# EasyEDA schematic 1-Schematic.json
TITLE: 7-digit Decade Box; REV: 1.0; Date: 2018-09-18; Sheet: 1/1; Drawn By: tardate
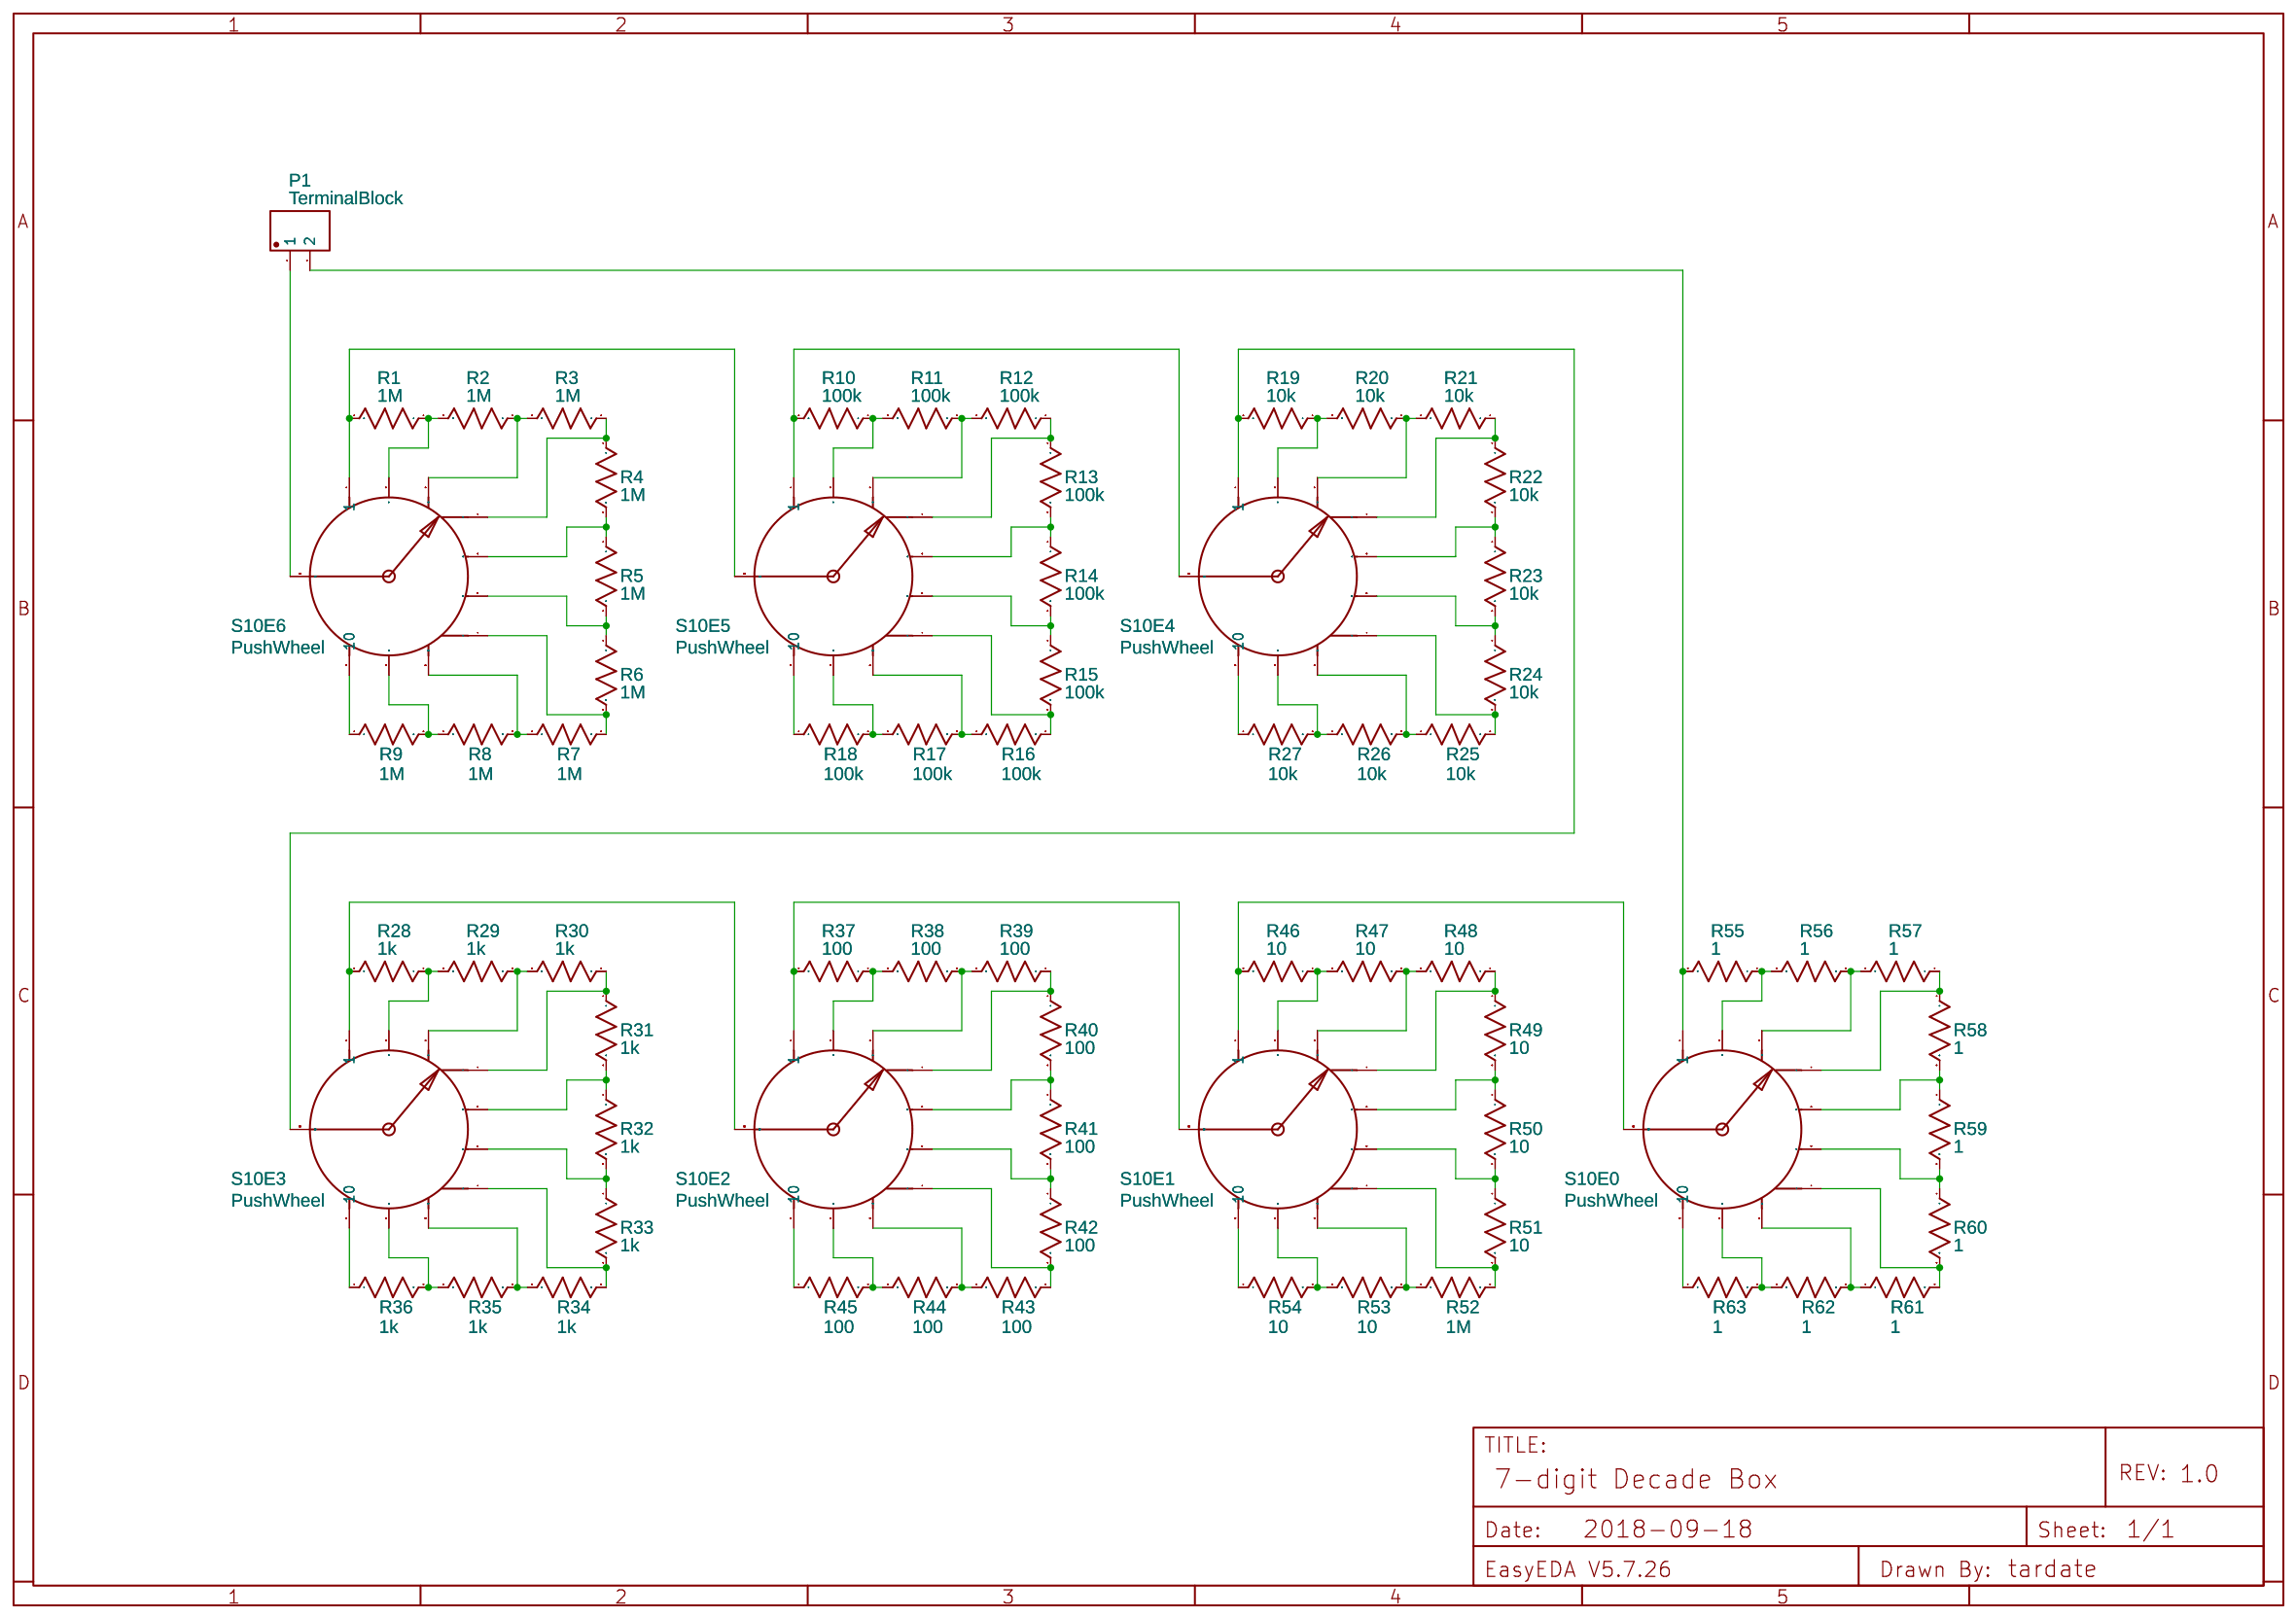
[diagram p0: schematic sheet]

## Parts
P1  TerminalBlock  [WJ2EDGVC-5.08-2P]
R1  1M  [AXIAL-0.3]
R2  1M  [AXIAL-0.3]
R3  1M  [AXIAL-0.3]
R4  1M  [AXIAL-0.3]
R5  1M  [AXIAL-0.3]
R6  1M  [AXIAL-0.3]
R7  1M  [AXIAL-0.3]
R8  1M  [AXIAL-0.3]
R9  1M  [AXIAL-0.3]
R10  100k  [AXIAL-0.3]
R11  100k  [AXIAL-0.3]
R12  100k  [AXIAL-0.3]
R13  100k  [AXIAL-0.3]
R14  100k  [AXIAL-0.3]
R15  100k  [AXIAL-0.3]
R16  100k  [AXIAL-0.3]
R17  100k  [AXIAL-0.3]
R18  100k  [AXIAL-0.3]
R19  10k  [AXIAL-0.3]
R20  10k  [AXIAL-0.3]
R21  10k  [AXIAL-0.3]
R22  10k  [AXIAL-0.3]
R23  10k  [AXIAL-0.3]
R24  10k  [AXIAL-0.3]
R25  10k  [AXIAL-0.3]
R26  10k  [AXIAL-0.3]
R27  10k  [AXIAL-0.3]
R28  1k  [AXIAL-0.3]
R29  1k  [AXIAL-0.3]
R30  1k  [AXIAL-0.3]
R31  1k  [AXIAL-0.3]
R32  1k  [AXIAL-0.3]
R33  1k  [AXIAL-0.3]
R34  1k  [AXIAL-0.3]
R35  1k  [AXIAL-0.3]
R36  1k  [AXIAL-0.3]
R37  100  [AXIAL-0.3]
R38  100  [AXIAL-0.3]
R39  100  [AXIAL-0.3]
R40  100  [AXIAL-0.3]
R41  100  [AXIAL-0.3]
R42  100  [AXIAL-0.3]
R43  100  [AXIAL-0.3]
R44  100  [AXIAL-0.3]
R45  100  [AXIAL-0.3]
R46  10  [AXIAL-0.3]
R47  10  [AXIAL-0.3]
R48  10  [AXIAL-0.3]
R49  10  [AXIAL-0.3]
R50  10  [AXIAL-0.3]
R51  10  [AXIAL-0.3]
R52  1M  [AXIAL-0.3]
R53  10  [AXIAL-0.3]
R54  10  [AXIAL-0.3]
R55  1  [AXIAL-0.3]
R56  1  [AXIAL-0.3]
R57  1  [AXIAL-0.3]
R58  1  [AXIAL-0.3]
R59  1  [AXIAL-0.3]
R60  1  [AXIAL-0.3]
R61  1  [AXIAL-0.3]
R62  1  [AXIAL-0.3]
R63  1  [AXIAL-0.3]
S10E0  PushWheel  [ROTARY_SWITCH_1X10_KIT]
S10E1  PushWheel  [ROTARY_SWITCH_1X10_KIT]
S10E2  PushWheel  [ROTARY_SWITCH_1X10_KIT]
S10E3  PushWheel  [ROTARY_SWITCH_1X10_KIT]
S10E4  PushWheel  [ROTARY_SWITCH_1X10_KIT]
S10E5  PushWheel  [ROTARY_SWITCH_1X10_KIT]
S10E6  PushWheel  [ROTARY_SWITCH_1X10_KIT]

## Library data of the parts
P1 = -: Supplier Part: C8445; Supplier: LCSC; Manufacturer: ReliaPro; image: //image.lceda.cn/szlcsc/C8445.jpg
R1-R63 = Res_AXIAL-0.3(1/8W)_US: Manufacturer Part: ?
S10E0-S10E6 = -: SWCH-12120; Contributor: SparkFun; Manufacturer Part: ?

## Nets
Net-(P1-1): P1.1 S10E6.COMMON
Net-(P1-2): P1.2 R55.2 S10E0.1
Net-(R1-1): R1.1 R2.2 S10E6.2
Net-(R1-2): R1.2 S10E5.COMMON S10E6.1
Net-(R2-1): R2.1 R3.2 S10E6.3
Net-(R3-1): R3.1 R4.1 S10E6.4
Net-(R4-2): R4.2 R5.1 S10E6.5
Net-(R5-2): R5.2 R6.1 S10E6.6
Net-(R6-2): R6.2 R7.2 S10E6.7
Net-(R7-1): R7.1 R8.2 S10E6.8
Net-(R8-1): R8.1 R9.2 S10E6.9
Net-(R9-1): R9.1 S10E6.10
Net-(R10-1): R10.1 R11.2 S10E5.2
Net-(R10-2): R10.2 S10E4.COMMON S10E5.1
Net-(R11-1): R11.1 R12.2 S10E5.3
Net-(R12-1): R12.1 R13.1 S10E5.4
Net-(R13-2): R13.2 R14.1 S10E5.5
Net-(R14-2): R14.2 R15.1 S10E5.6
Net-(R15-2): R15.2 R16.2 S10E5.7
Net-(R16-1): R16.1 R17.2 S10E5.8
Net-(R17-1): R17.1 R18.2 S10E5.9
Net-(R18-1): R18.1 S10E5.10
Net-(R19-1): R19.1 R20.2 S10E4.2
Net-(R19-2): R19.2 S10E3.COMMON S10E4.1
Net-(R20-1): R20.1 R21.2 S10E4.3
Net-(R21-1): R21.1 R22.1 S10E4.4
Net-(R22-2): R22.2 R23.1 S10E4.5
Net-(R23-2): R23.2 R24.1 S10E4.6
Net-(R24-2): R24.2 R25.2 S10E4.7
Net-(R25-1): R25.1 R26.2 S10E4.8
Net-(R26-1): R26.1 R27.2 S10E4.9
Net-(R27-1): R27.1 S10E4.10
Net-(R28-1): R28.1 R29.2 S10E3.2
Net-(R28-2): R28.2 S10E2.COMMON S10E3.1
Net-(R29-1): R29.1 R30.2 S10E3.3
Net-(R30-1): R30.1 R31.1 S10E3.4
Net-(R31-2): R31.2 R32.1 S10E3.5
Net-(R32-2): R32.2 R33.1 S10E3.6
Net-(R33-2): R33.2 R34.2 S10E3.7
Net-(R34-1): R34.1 R35.2 S10E3.8
Net-(R35-1): R35.1 R36.2 S10E3.9
Net-(R36-1): R36.1 S10E3.10
Net-(R37-1): R37.1 R38.2 S10E2.2
Net-(R37-2): R37.2 S10E1.COMMON S10E2.1
Net-(R38-1): R38.1 R39.2 S10E2.3
Net-(R39-1): R39.1 R40.1 S10E2.4
Net-(R40-2): R40.2 R41.1 S10E2.5
Net-(R41-2): R41.2 R42.1 S10E2.6
Net-(R42-2): R42.2 R43.2 S10E2.7
Net-(R43-1): R43.1 R44.2 S10E2.8
Net-(R44-1): R44.1 R45.2 S10E2.9
Net-(R45-1): R45.1 S10E2.10
Net-(R46-1): R46.1 R47.2 S10E1.2
Net-(R46-2): R46.2 S10E0.COMMON S10E1.1
Net-(R47-1): R47.1 R48.2 S10E1.3
Net-(R48-1): R48.1 R49.1 S10E1.4
Net-(R49-2): R49.2 R50.1 S10E1.5
Net-(R50-2): R50.2 R51.1 S10E1.6
Net-(R51-2): R51.2 R52.2 S10E1.7
Net-(R52-1): R52.1 R53.2 S10E1.8
Net-(R53-1): R53.1 R54.2 S10E1.9
Net-(R54-1): R54.1 S10E1.10
Net-(R55-1): R55.1 R56.2 S10E0.2
Net-(R56-1): R56.1 R57.2 S10E0.3
Net-(R57-1): R57.1 R58.1 S10E0.4
Net-(R58-2): R58.2 R59.1 S10E0.5
Net-(R59-2): R59.2 R60.1 S10E0.6
Net-(R60-2): R60.2 R61.2 S10E0.7
Net-(R61-1): R61.1 R62.2 S10E0.8
Net-(R62-1): R62.1 R63.2 S10E0.9
Net-(R63-1): R63.1 S10E0.10
